# EAGLE design Test_4 (EAGLE 9.6.2)
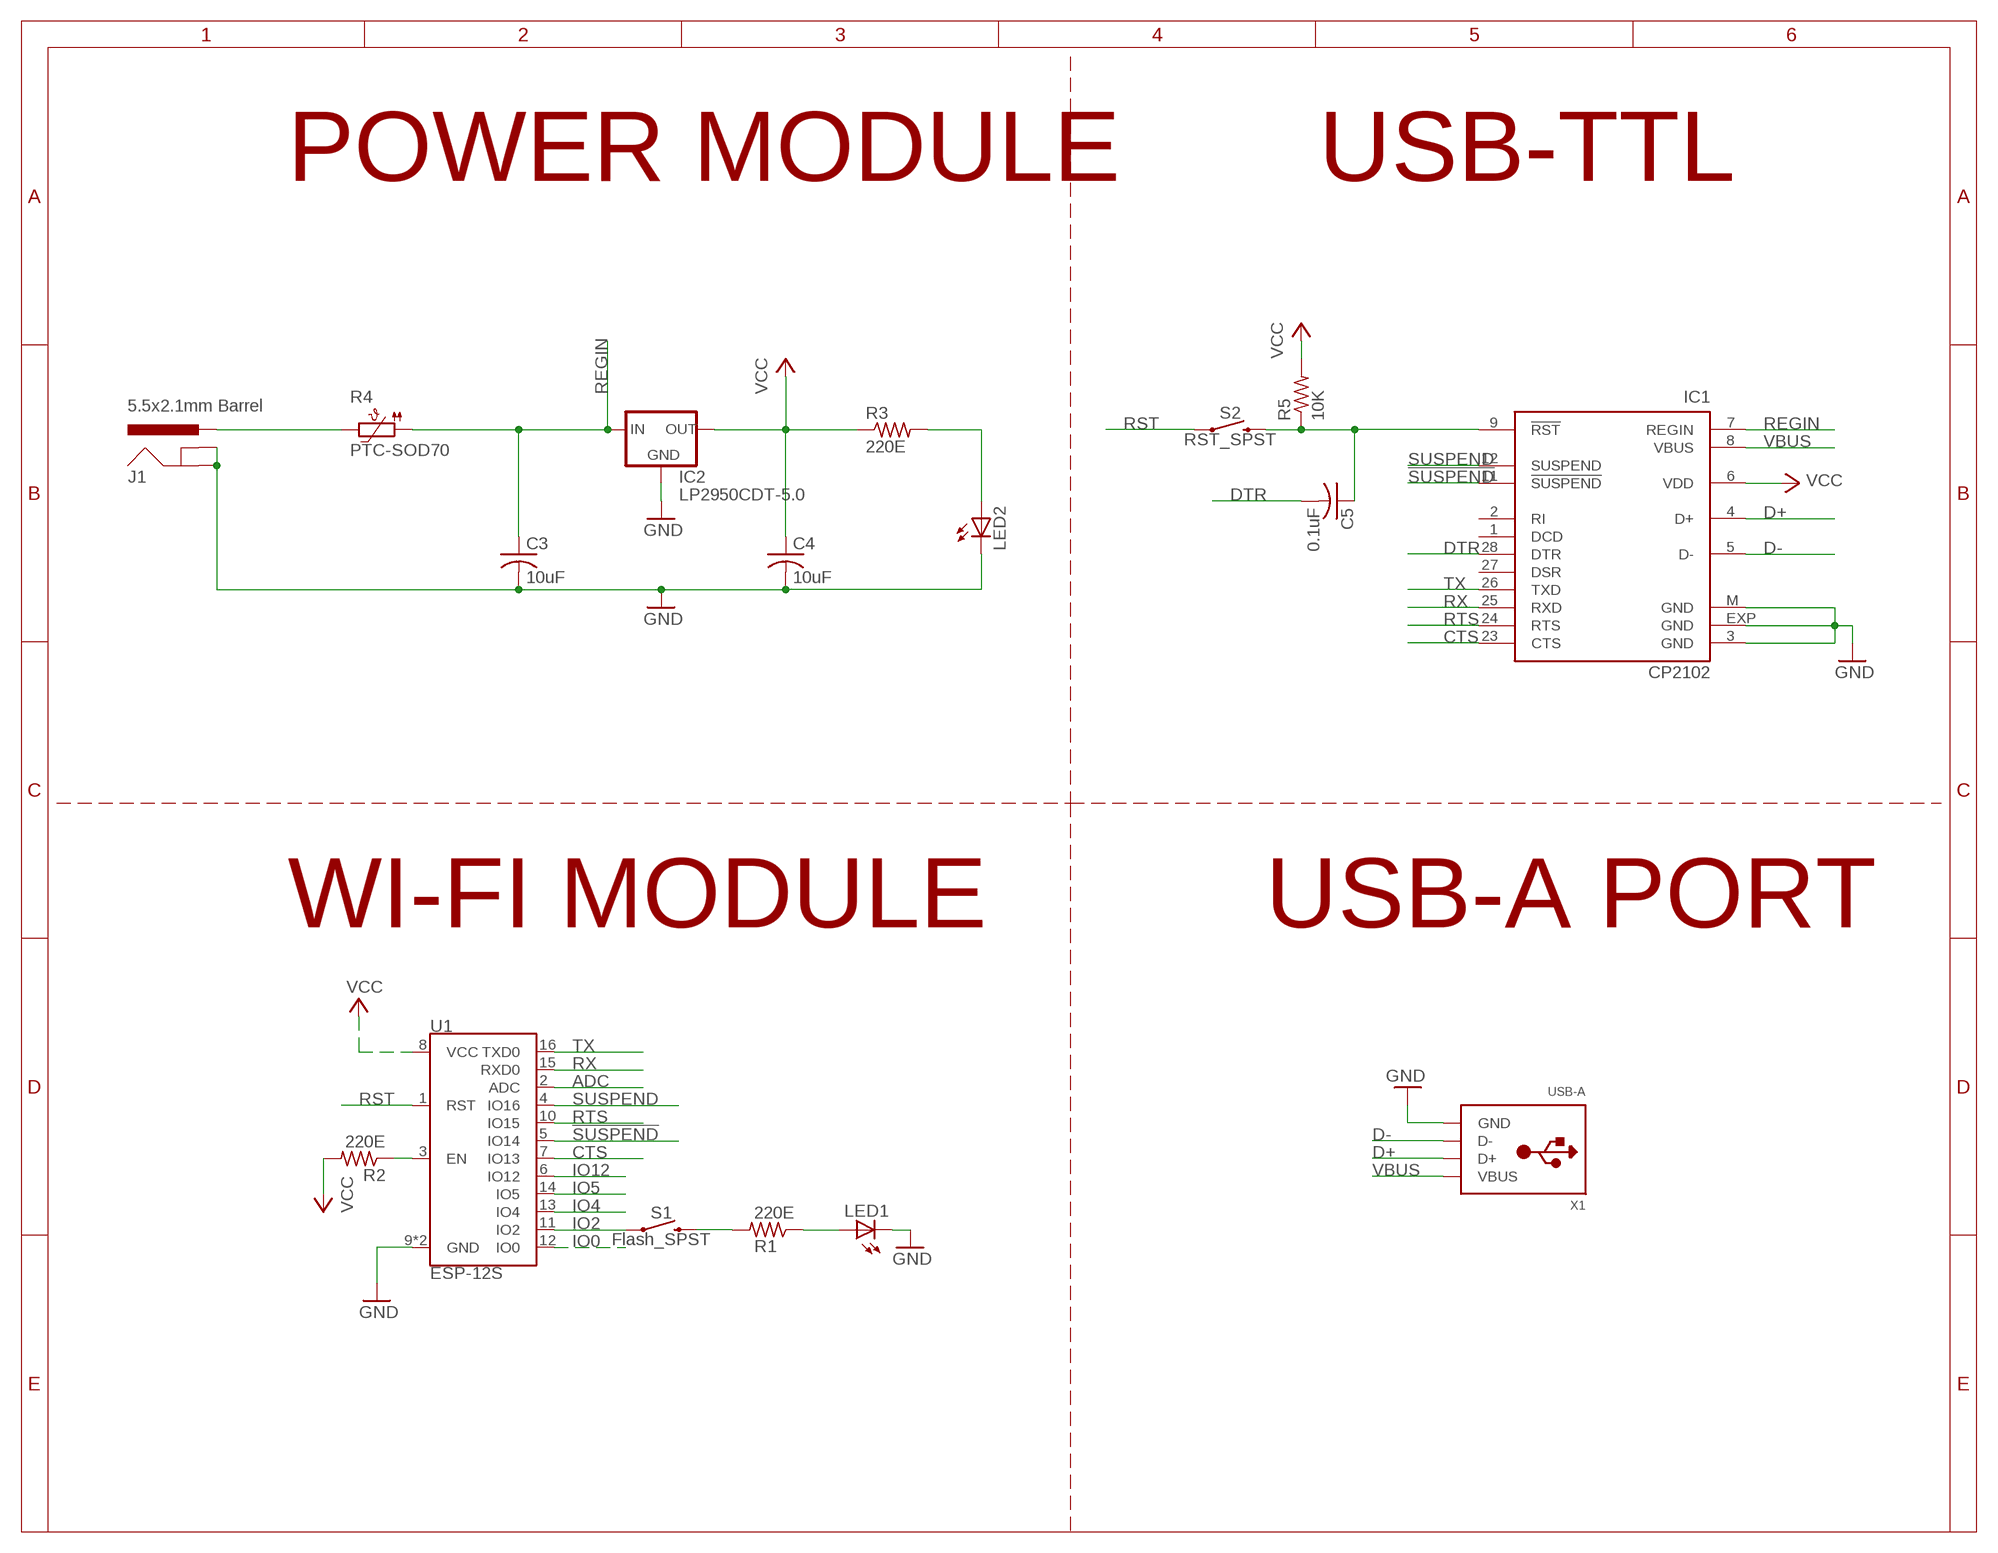
[diagram p0: schematic, sheet 1]

## Parts
C3  10uF  C-USC0805  [C0805]
C4  10uF  C-USC0805  [C0805]
C5  0.1uF  C-USC0805  [C0805]
IC1  CP2102  [MLP28]
IC2  LP2950CDT-5.0  [DPACK]
J1  5.5x2.1mm Barrel  POWER_JACKSMD  [POWER_JACK_SMD]
LED1  LEDCHIPLED_0805  [CHIPLED_0805]
LED2  LEDCHIPLED_0805  [CHIPLED_0805]
R1  220E  R-US_R0805  [R0805]
R2  220E  R-US_R0805  [R0805]
R3  220E  R-US_R0805  [R0805]
R4  PTC-SOD70  [SOD70]
R5  10K  R-US_R0805  [R0805]
S1  Flash_SPST  MOMENTARY-SWITCH-SPST-SMD-5.2-TALL-REDUNDANT  [TACTILE_SWITCH_SMD_5.2MM]
S2  RST_SPST  MOMENTARY-SWITCH-SPST-SMD-5.2-TALL-REDUNDANT  [TACTILE_SWITCH_SMD_5.2MM]
U1  ESP-12S  [ESP-12S]
X1  USB-A  [MOLEX_480371000]

## Nets
!SUSPEND: IC1.11(!SUSPEND) U1.5(IO14)
+5V: C4.1 IC1.6(VDD) IC2.3(OUT) R2.2 R3.1 R5.2 ; supply symbol labelled VCC
ADC: U1.2(ADC)
CTS: IC1.23(CTS) U1.7(IO13)
D+: IC1.4(D+) X1.3(D+)
D-: IC1.5(D-) X1.2(D-)
DTR: C5.2 IC1.28(DTR)
GND: C3.2 C4.2 IC2.4(GND) J1.GND(GNDBREAK) J1.P$4(GND) LED1.C LED2.C U1.9(GND) U1.P$1(GND) X1.4(GND)
IO0: U1.12(IO0)
IO2: S1.1 S1.2 U1.11(IO2)
IO4: U1.13(IO4)
IO5: U1.14(IO5)
IO12: U1.6(IO12)
N$1: LED1.A R1.1
N$6: IC1.3(GND) IC1.EXP(GND) IC1.M(GND) ; supply symbol labelled GND
N$8: R1.2 S1.3 S1.4
N$10: J1.VIN0(PWR) R4.2
N$11: LED2.A R3.2
N$14: C5.1 IC1.9(!RST) R5.1 S2.3 S2.4
N$27: R2.1 U1.3(EN)
REGIN: C3.1 IC1.7(REGIN) IC2.1(IN) R4.1
RST: S2.1 S2.2 U1.1(RST)
RTS: IC1.24(RTS) U1.10(IO15)
RX: IC1.25(RXD) U1.15(RXD0)
SUSPEND: IC1.12(SUSPEND) U1.4(IO16)
TX: IC1.26(TXD) U1.16(TXD0)
VBUS: IC1.8(VBUS) X1.1(VBUS)
VCC: U1.8(VCC)
Unconnected: IC1.1(DCD) IC1.2(RI) IC1.27(DSR)

## Notes on the sheet
- POWER MODULE | USB-TTL
- WI-FI MODULE | USB-A PORT

## Library data of the parts
C3-C5 = rcl:C-US: CAPACITOR, American symbol; SPICEPREFIX: C
IC1 = silabs:CP210*: Single-Chip USB to UART Bridge Source: www.silabs.com .. CP2101.pdf / cp2102.pdf; MF: FARNELL; MPN: CP2102-GM; OC_FARNELL: 9282130; OC_NEWARK: 30K5635
IC2 = v-reg:LP2950?*: Source: http://cache.national.com/ds/LP/LP2950.pdf
J1 = SparkFun-Connectors:POWER_JACK: Power Jack Connector This is the standard 5.5mm barrel jack for power. The PTH is the most common, proven, reliable, footprint. The Slot footprint only works if the mill layer is transmitted to the PCB fab house so be warned. Here are the connectors we sell at SparkFun: DC Barrel Power Jack/Connector <https://www.sparkfun.com/products/119> (PRT-00119) DC Barrel Power Jack/Connector (SMD) <https://www.sparkfun.com/products/12748> (PRT-12748) DC Barrel Jack Adapter - Breadboard Compatible <https://www.sparkfun.com/products/10811> (PRT-10811) It is used on this SparkFun product (and many, many others): SparkFun RedBoard - Programmed with Arduino <https://www.sparkfun.com/products/12757> (DEV-12757) Also, if you need a mating power supply or connector, please check these out: Wall Adapter Power Supply - 9VDC 650mA <https://www.sparkfun.com/products/298> (TOL-00298) DC Barrel Jack Adapter - Male <https://www.sparkfun.com/products/10287> (PRT-10287); PROD_ID: CONN-08106; SF_ID: PRT-12748
LED1 LED2 = adafruit:LED: LED OSRAM: - CHIPLED LG R971, LG N971, LY N971, LG Q971, LY Q971, LO R971, LY R971 LH N974, LH R974 LS Q976, LO Q976, LY Q976 LO Q996 - Hyper CHIPLED LW Q18S LB Q993, LB Q99A, LB R99A - SideLED LS A670, LO A670, LY A670, LG A670, LP A670 LB A673, LV A673, LT A673, LW A673 LH A674 LY A675 LS A676, LA A676, LO A676, LY A676, LW A676 LS A679, LY A679, LG A679 - Hyper Micro SIDELED® LS Y876, LA Y876, LO Y876, LY Y876 LT Y87S - SmartLED LW L88C, LW L88S LB L89C, LB L89S, LG L890 LS L89K, LO L89K, LY L89K LS L896, LA L896, LO L896, LY L896 - TOPLED LS T670, LO T670, LY T670, LG T670, LP T670 LSG T670, LSP T670, LSY T670, LOP T670, LYG T670 LG T671, LOG T671, LSG T671 LB T673, LV T673, LT T673, LW T673 LH T674 LS T676, LA T676, LO T676, LY T676, LB T676, LH T676, LSB T676, LW T676 LB T67C, LV T67C, LT T67C, LS T67K, LO T67K, LY T67K, LW E67C LS E67B, LA E67B, LO E67B, LY E67B, LB E67C, LV E67C, LT E67C LW T67C LS T679, LY T679, LG T679 LS T770, LO T770, LY T770, LG T770, LP T770 LB T773, LV T773, LT T773, LW T773 LH T774 LS E675, LA E675, LY E675, LS T675 LS T776, LA T776, LO T776, LY T776, LB T776 LHGB T686 LT T68C, LB T68C - Hyper Mini TOPLED® LB M676 - Mini TOPLED Santana® LG M470 LS M47K, LO M47K, LY M47K Source: http://www.osram.convergy.de/
R1-R3 R5 = rcl:R-US_: RESISTOR, American symbol; SPICEPREFIX: R
R4 = ptc-ntc:PTC-: Positive Temperature Coefficient Resistor (PTC) termistor Philips KTY81-210 - KTY81-252 Source: 153627-da-01-en-Temperatur-Sensor_KTY10-6_Philips.pdf; OC_FARNELL: unknown; OC_NEWARK: unknown
S1 S2 = SparkFun-Switches:MOMENTARY-SWITCH-SPST: Momentary Switch (Pushbutton) - SPST Normally-open (NO) SPST momentary switches (buttons, pushbuttons). Variants PTH-12MM - 12mm square, through-hole Momentary Pushbutton Switch - 12mm Square <https://www.sparkfun.com/products/9190> (COM-09190) PTH-6.0MM, PTH-6.0MM-KIT - 6.0mm square, through-hole Mini Pushbutton Switch <https://www.sparkfun.com/products/97> (COM-00097) KIT package intended for soldering kit's - only one side of pads' copper is exposed. PTH-RIGHT-ANGLE-KIT - Right-angle, through-hole Right Angle Tactile Button <https://www.sparkfun.com/products/10791> - Used on SparkFun BigTime Watch Kit <https://www.sparkfun.com/products/11734> SMD-12MM - 12mm square, surface-mount Tactile Button - SMD (12mm) <https://www.sparkfun.com/products/12993> (COM-12993) Used on SparkFun PicoBoard <https://www.sparkfun.com/products/11888> SMD-4.5MM - 4.5mm Square Trackball Switch Used on SparkFun Blackberry Trackballer Breakout <https://www.sparkfun.com/products/13169> SMD-4.6MMX2.8MM - 4.60mm x 2.80mm, surface mount Used on SparkFun Pro Micro - RP2040 <https://www.sparkfun.com/products/17717> SMD-5.2MM, SMD-5.2-REDUNDANT - 5.2mm square, surface-mount Mini Pushbutton Switch - SMD <https://www.sparkfun.com/products/8720> (COM-08720) Used on Arduino Pro Mini <https://www.sparkfun.com/products/11114> REDUNDANT package connects both switch circuits together SMD-6.0X3.5MM - 6.0 x 3.5mm, surface mount Momentary Reset Switch SMD <https://www.sparkfun.com/products/8229> (COM-08229) SMD-6.2MM-TALL - 6.2mm square, surface mount Tactile Button - SMD (6mm) <https://www.sparkfun.com/products/12992> Used on SparkFun Digital Sandbox <https://www.sparkfun.com/products/12651> SMD-RIGHT-ANGLE - Right-angle, surface mount Used on SparkFun Block for Intel® Edison - Arduino <https://www.sparkfun.com/products/13036>; PROD_ID: SWCH-14139
U1 = SparkFun-RF:ESP-12S: AI-Thinker ESP-12S ESP-12S WiFi module is developed by AI-Thinker Co.,Ltd, core processor ESP8266 in smaller sizes of the module encapsulates Tensilica L106 integrates industry-leading ultra low power 32-bit MCU micro, with the 16-bit short mode, clock speed support 80 MHz, 160 MHz, supports the RTOS, integrated Wi-Fi MAC/BB/RF/PA/LNA, on-board antennas.; PROD_ID: IC-14115
X1 = adafruit:USB-A: USB type A 'plug' Used for things that can directly connect to a USB port, say USB key

## Board
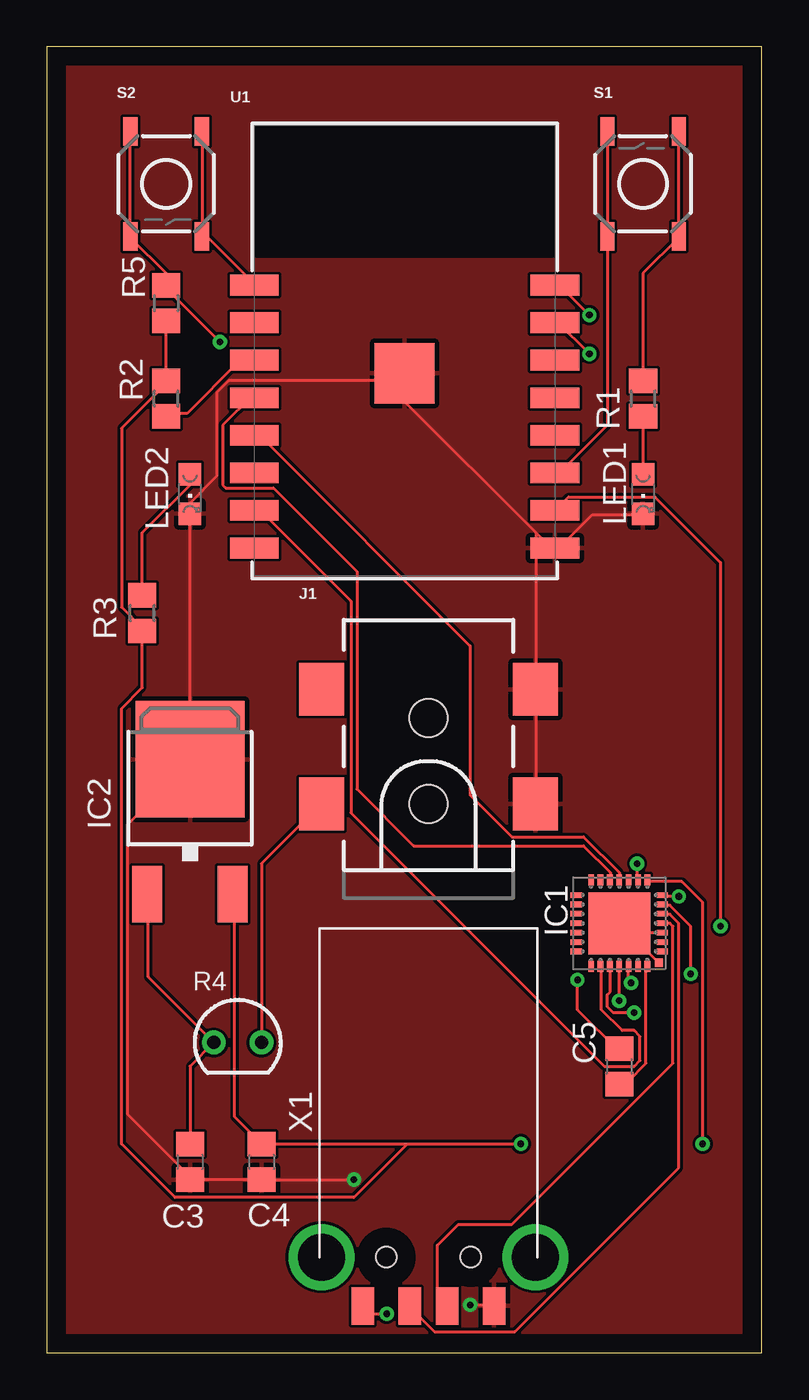
[diagram p1: board, top side]
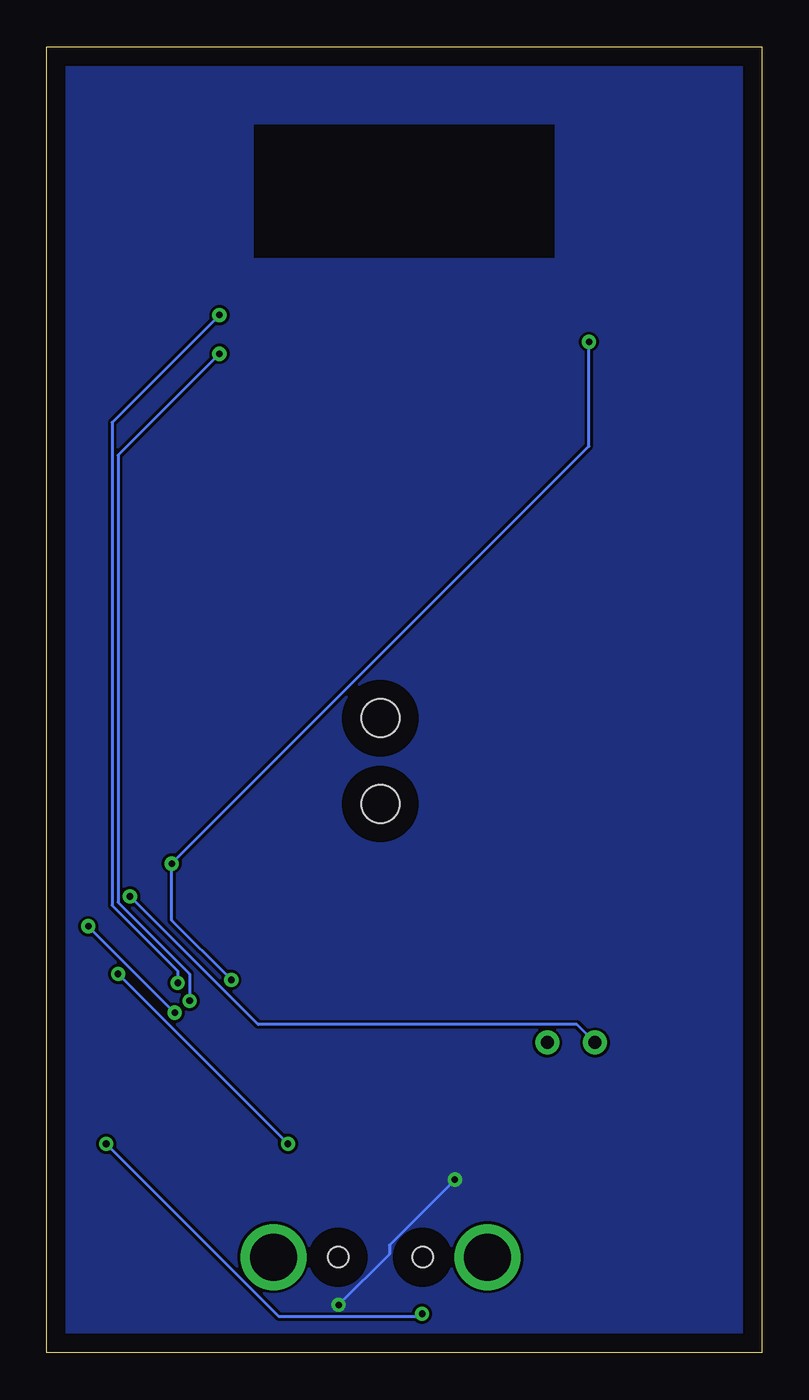
[diagram p2: board, bottom side, seen from below]

Size 38.08 x 69.52 mm. Coordinates in mm from the lower left corner, seen from the top.
Outline: 0,0 38.08,0 38.08,69.52 0,69.52 0,0
Copper layers (1*16): Top 0.035mm / dielectric 1.5mm / Bottom 0.035mm
Design rules "default": minimum track width 6mil, minimum drill 0.35mm, track to track 6mil, track to pad 6mil, pad to pad 6mil, via to via 6mil, smd to smd 6mil, copper to edge 40mil, drill to drill 6mil, minimum pad ring 10mil, minimum via ring 8mil, stop-mask expansion 4mil, vias tented up to drill 0mil, thermal gap 10mil

### Footprints (pad centres in the part's own frame; a part is rotated, then mirrored left to right if it is on the bottom)
C0805 = smd 1.3 x 1.5: 1 -0.95,0; 2 0.95,0
MLP28 = smd 0.6 x 0.3: 1 -2.3,1.5; 2 -2.3,1; 3 -2.3,0.5; 4 -2.3,0; 5 -2.3,-0.5; 6 -2.3,-1; 7 -2.3,-1.5; 15 2.3,-1.5; 16 2.3,-1; 17 2.3,-0.5; 18 2.3,0; 19 2.3,0.5; 20 2.3,1; 21 2.3,1.5 | smd 0.3 x 0.6: 8 -1.5,-2.3; 9 -1,-2.3; 10 -0.5,-2.3; 11 0,-2.3; 12 0.5,-2.3; 13 1,-2.3; 14 1.5,-2.3; 22 1.5,2.3; 23 1,2.3; 24 0.5,2.3; 25 0,2.3; 26 -0.5,2.3; 27 -1,2.3; 28 -1.5,2.3 | smd 3.3 x 3.3: EXP 0,0 | smd 0.435 x 0.435: M -2.103,2.103
DPACK = smd 1.6 x 3: 1 -2.28,-4.8; 3 2.28,-4.8 | smd 5.8 x 6.2: 4 0,2.38
POWER_JACK_SMD = smd 2.8 x 2.4: GND 0,-5.7; P$4 6.1,-5.7; VIN0 0,5.7; VIN1 6.1,5.7 | hole 2.032: 0,0; 4.572,0
CHIPLED_0805 = smd 1.2 x 1.2: A 0,-1.05; C 0,1.05
R0805 = smd 1.3 x 1.5: 1 -0.95,0; 2 0.95,0
SOD70 = drill 0.7 pad 1.27: 1 -1.27,0; 2 1.27,0
TACTILE_SWITCH_SMD_5.2MM = smd 1.524 x 0.762: 1 -2.794,1.905; 2 2.794,1.905; 3 -2.794,-1.905; 4 2.794,-1.905
ESP-12S = smd 2.6 x 1.1: 1 -8,3.5; 2 -8,1.5; 3 -8,-0.5; 4 -8,-2.5; 5 -8,-4.5; 6 -8,-6.5; 7 -8,-8.5; 8 -8,-10.5; 9 8,-10.5; 10 8,-8.5; 11 8,-6.5; 12 8,-4.5; 13 8,-2.5; 14 8,-0.5; 15 8,1.5; 16 8,3.5 | smd 3.2 x 3.2: P$1 0,-1.2
MOLEX_480371000 = smd 1.2 x 2: 1 3.5,2.6; 2 1,2.6; 3 -1,2.6; 4 -3.5,2.6 | drill 2.5: M1 -5.7,0; M2 5.7,0 | hole 1.1: -2.25,0; 2.25,0

### Placement (x,y rotation side)
C3  7.62,10.16 270 top
C4  11.43,10.16 270 top
C5  30.48,15.24 270 top
IC1  30.48,22.86 180 top
IC2  7.62,29.21 0 top
J1  20.32,29.21 90 top
LED1  31.75,45.72 180 top
LED2  7.62,45.72 180 top
R1  31.75,50.8 90 top
R2  6.35,50.8 90 top
R3  5.08,39.37 90 top
R4  10.16,16.51 0 top
R5  6.35,55.88 270 top
S1  31.75,62.23 90 top
S2  6.35,62.23 270 top
U1  19.05,53.34 0 top
X1  20.32,5.08 180 top

### Tracks (layer width: path | path; a pad name or v marks a point on that pad's centre or on a via)
!SUSPEND
  Top 0.152: IC1.11 30.48,25.56 28.57,27.46 24.77,27.46 22.54,29.69 22.54,37.62 11.43,48.74 11.11,48.74 U1.5
+5V  (via drill 0.35)
  Top 0.152: R5.2 R2.2 6.35,51.59 3.97,49.21 3.97,39.69 5.08,38.58 R3.1 5.08,35.4 3.97,34.29 3.97,11.11 6.83,8.26 16.35,8.26 19.21,11.11 | v34.29,20.16 34.29,22.7 33.18,23.81 32.86,23.81 IC1.6 | C4.1 19.21,11.11 | 19.21,11.11 v25.24,11.11 | C4.1 10,12.54 10,24.29 IC2.3 | C4.1
  Bottom 0.152: v25.24,11.11 v34.29,20.16
CTS
  Top 0.152: IC1.23 29.53,20.48 29.53,18.26 30.64,17.14 31.27,17.14 31.59,16.83 31.59,15.56 31.27,15.24 29.69,15.24 16.19,28.73 16.19,40.01 11.43,44.77 11.11,44.77 U1.7
D+
  Top 0.152: IC1.4 33.18,22.86 33.34,22.7 33.34,15.4 24.77,6.83 21.91,6.83 20.8,5.71 20.8,3.02 21.27,2.54 X1.3
D-
  Top 0.152: IC1.5 32.86,23.34 33.18,23.34 33.66,22.86 33.66,9.84 24.92,1.11 20.64,1.11 19.37,2.38 X1.2
DTR
  Top 0.152: IC1.28 31.91,20.48 31.91,15.4 30.96,14.45 30.48,14.45 C5.2
GND  (via drill 0.35)
  Top 0.152: C4.2 C3.2 7.62,9.37 4.29,12.7 4.29,28.1 7.62,31.43 IC2.4 LED2.C 7.62,45.24 9.05,46.67 9.05,51.12 9.68,51.75 19.05,51.75 | v22.54,2.54 23.81,2.54 X1.4 | C4.2 v16.35,9.21 | C4.2 | J1.GND 26.04,29.21 26.04,35.24 J1.P$4 26.04,35.4 26.04,43.66 | LED1.C 31.75,44.61 29.05,44.61 27.15,42.7 U1.9 26.99,42.7 26.04,43.66 | 19.05,51.75 19.05,50.64 26.04,43.66 | 19.05,51.75 U1.P$1 19.05,52.07
  Bottom 0.152: v22.54,2.54 19.84,5.24 19.84,5.71 v16.35,9.21
  pour Top: 0,69.85 0,0 38.1,0 38.1,69.85
  pour Bottom: 0,69.85 0,0 38.1,0 38.1,69.85
IO2
  Top 0.152: S1.2 S1.1 29.84,49.37 27.46,46.99 27.15,46.99 U1.11
N$1
  Top 0.152: R1.1 LED1.A
N$6
  Top 0.152: 30.96,22.38 IC1.M | 30.96,22.38 32.7,22.38 IC1.3 | 30.96,22.38 IC1.EXP
N$8
  Top 0.152: R1.2 31.75,57.47 33.66,59.37 S1.3 S1.4
N$10
  Top 0.152: R4.2 11.43,26.04 14.61,29.21 J1.VIN0
N$11
  Top 0.152: LED2.A 7.62,46.2 5.08,43.66 R3.2
N$14  (via drill 0.35)
  Top 0.152: S2.3 S2.4 4.45,59.37 6.35,57.47 R5.1 6.35,56.67 v9.21,53.82 | v31.43,26.04 31.43,25.24 IC1.9 | v28.26,19.84 28.26,18.26 30.48,16.03 C5.1
  Bottom 0.152: v28.26,19.84 31.43,23.02 v31.43,26.04 9.21,48.26 v9.21,53.82
N$27
  Top 0.152: R2.1 6.35,50.01 7.46,50.01 10.16,52.7 10.95,52.7 U1.3
REGIN  (via drill 0.35)
  Top 0.152: v33.66,24.29 32.86,24.29 IC1.7 | C3.1 7.62,15.24 R4.1 5.4,20 5.4,24.29 IC2.1
  Bottom 0.152: v33.66,24.29 26.83,17.46 9.84,17.46 R4.1
RST
  Top 0.152: S2.1 8.26,59.69 | 8.26,59.69 S2.2 8.26,59.53 | 8.26,59.69 10.95,56.99 U1.1
RTS  (via drill 0.35)
  Top 0.152: v31.27,18.1 30.16,18.1 29.84,18.41 29.84,19.05 30,19.21 30,20.48 IC1.24 | v35.88,22.7 35.88,42.07 32.38,45.56 27.78,45.56 27.15,44.93 U1.10
  Bottom 0.152: v35.88,22.7 v31.27,18.1
RX  (via drill 0.35)
  Top 0.152: v30.48,18.73 IC1.25 | v28.89,53.18 27.15,54.93 U1.15
  Bottom 0.152: v30.48,18.73 30.48,20.16 34.29,23.97 34.29,47.78 v28.89,53.18
SUSPEND
  Top 0.152: IC1.12 30,25.24 30,25.56 28.57,26.99 19.53,26.99 16.51,30 16.51,41.59 12.06,46.04 9.53,46.04 9.37,46.2 9.37,49.37 10.95,50.96 U1.4
TX  (via drill 0.35)
  Top 0.152: v31.11,19.68 30.96,19.84 30.96,20.48 IC1.26 | v28.89,55.24 27.15,56.99 U1.16
  Bottom 0.152: v31.11,19.68 31.11,20.32 34.61,23.81 34.61,49.53 v28.89,55.24
VBUS  (via drill 0.35)
  Top 0.152: v34.92,11.11 34.92,23.97 33.81,25.08 32.07,25.08 IC1.8 | v18.1,2.06 17.14,2.06 16.83,2.38 X1.1
  Bottom 0.152: v34.92,11.11 25.72,1.91 18.26,1.91 v18.1,2.06